# EasyEDA Pro project ProPrj_ct mini board_2024-09-02.epro

# Schematic MiniCT
Board Name: Board1; Create Date: 2024-08-28; Company: Jeffrey Hein; Drawn: Jeffrey Hein; Part Number: mini-ct-01
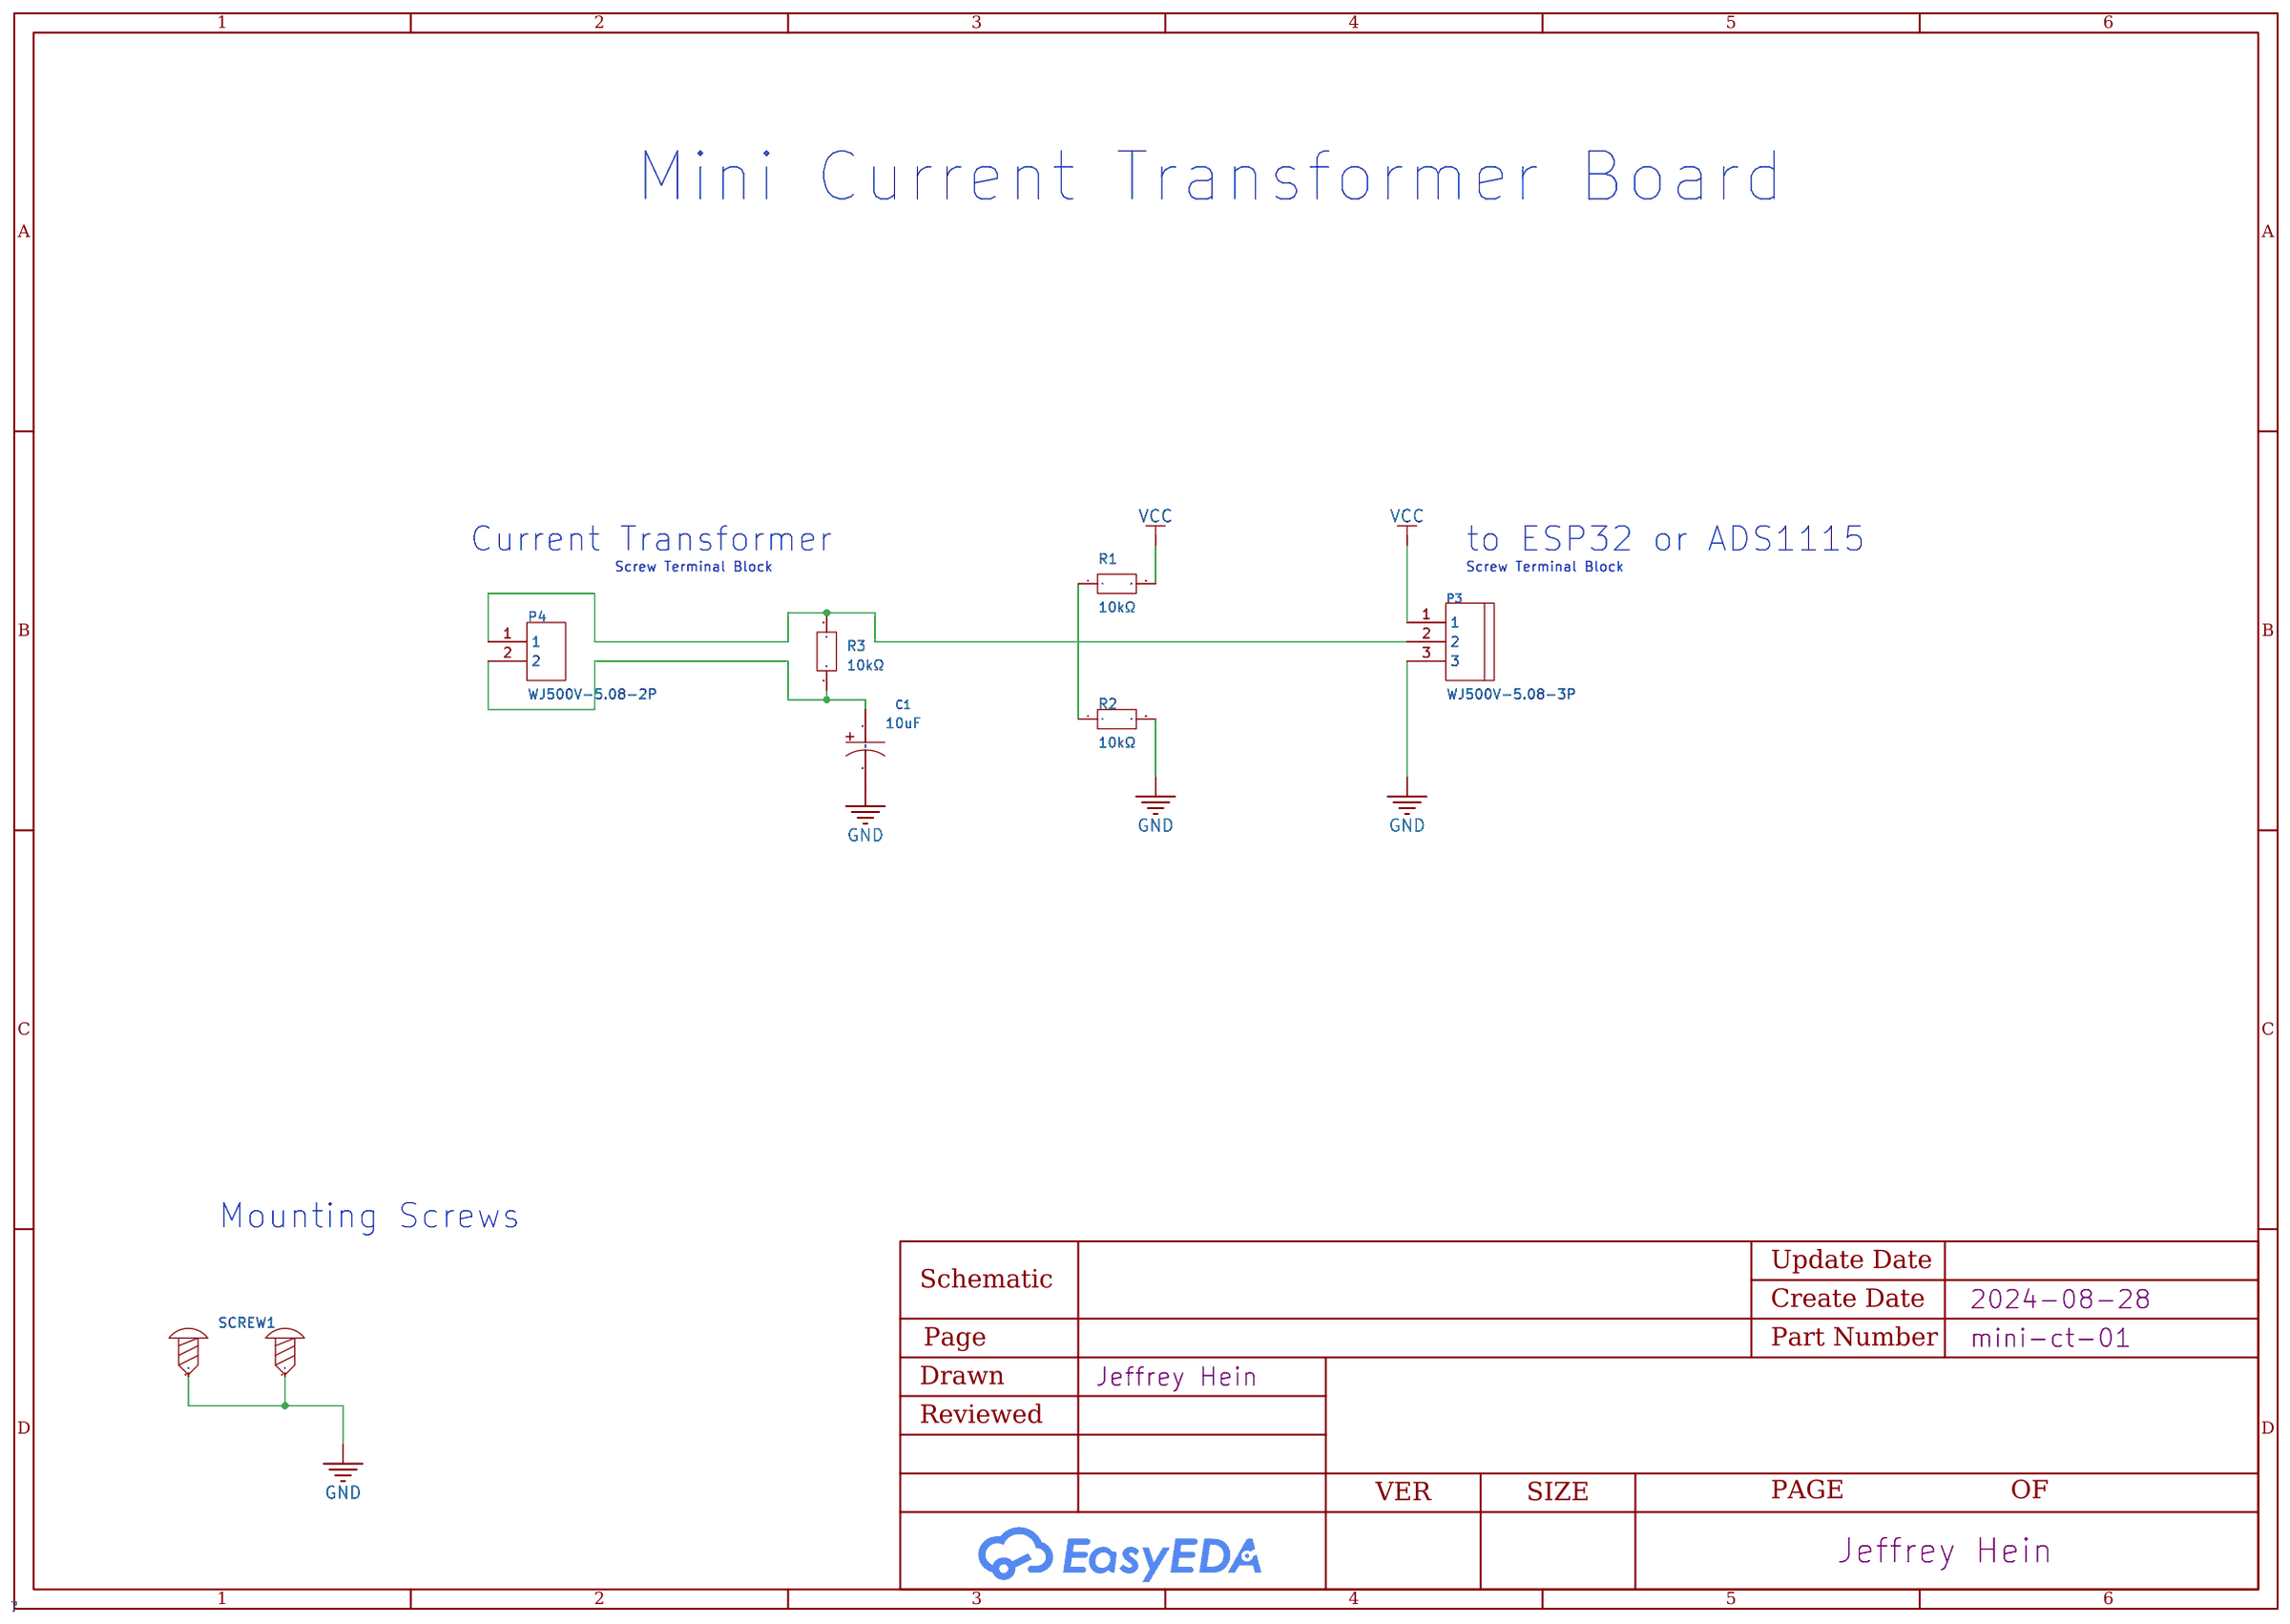
[diagram p0: schematic sheet]

## Parts
C1  10uF  [CAP-TH_BD5.0-P5.00-D1.0-FD]
P3  WJ500V-5.08-3P  [CONN-TH_3P-P5.00_WJ500V-5.08-3P]
P4  WJ500V-5.08-2P  [CONN-TH_2P-P5.00_WJ500V-5.08-2P]
R1  10kΩ  [RES-TH_BD2.4-L6.3-P10.30-D0.6]
R2  10kΩ  [RES-TH_BD2.4-L6.3-P10.30-D0.6]
R3  10kΩ  [RES-TH_BD2.4-L6.3-P10.30-D0.6]
SCREW1  -  [Screw-Hole-M4]
SCREW2  -  [Screw-Hole-M4]

## Library data of the parts
C1 = UVZ1C100MDD1TA: Capacitance: Tolerance:±20% Tolerance:±20% Rated Voltage: Ripple Current:35mA@120Hz Equivalent Series Resistance(ESR):- Lead Spacing:2mm φD: L: Lifetime @ Temp:1000hrs@105℃ Operating Temperature:-55℃~+105℃ Operating Temperature:-55℃~+105℃; LCSC Part Name: 10uF ±20% 16V; Supplier Part: C250876; Manufacturer: Nichicon(尼吉康); Supplier Footprint: 插件,D5xL11mm; Datasheet: https://atta.szlcsc.com/upload/public/pdf/source/20180925/C308870_1835EFB626D2D8CF3B207CFFD6F8F272.pdf; Supplier: LCSC; Tolerance: ±20%; Ripple Current: 35mA@120Hz; Lead Spacing: 2mm; Lifetime @ Temp: 1000hrs@105℃; Operating Temperature: -55℃~+105℃
P3 = WJ500V-5.08-3P: Structure:1x3P Pitch:5.08mm Color:Green Mounting Style:Straight Current Rating (Max):18A Voltage Rating (Max):250V Number of Pins:3P Number of Rows:1 Wire Gauge - AWG:14~30 Wire Gauge - AWG:14~30 Wire Gauge - mm2:2.5 Wire Gauge - mm2:2.5 Number of PINs Pe; LCSC Part Name: 5.08mm 1x3P 排数:1 每排P数:3 直插; Supplier Part: C72334; Manufacturer: KANGNEX(康奈克斯电气); Supplier Footprint: 插件,P=5.08mm; Datasheet: https://atta.szlcsc.com/upload/public/pdf/source/20191225/C72334_8A5EF831D67650233B6B1E3F2BC06274.pdf; Supplier: LCSC; Structure: 1x3P; Pitch: 5.08mm; Color: Green; Mounting Style: Straight; Current Rating (Max): 18A; Voltage Rating (Max): 250V; Number of Pins: 3P; Number of Rows: 1; Wire Gauge - AWG: 14~30; Wire Gauge - mm2: 2.5; Number of PINs Per Row: 3; Operating Temperature Range: -40℃~+105℃
P4 = WJ500V-5.08-2P: Structure:1x2P Pitch:5.08mm Color:Green Mounting Style:Straight Current Rating (Max):18A Voltage Rating (Max):250V Number of Pins:2P Number of Rows:1 Wire Gauge - AWG:14~30 Wire Gauge - AWG:14~30 Wire Gauge - mm2:2.5 Wire Gauge - mm2:2.5 Number of PINs Pe; LCSC Part Name: 1x2P 5.08mm 直插 排数:1 每排P数:2; Supplier Part: C8465; Manufacturer: KANGNEX(康奈克斯电气); Supplier Footprint: 插件,P=5.08mm; Datasheet: https://atta.szlcsc.com/upload/public/pdf/source/20191225/C8465_02D34CE5B5B4A53DF5891601D97FA9F4.pdf; Supplier: LCSC; Structure: 1x2P; Pitch: 5.08mm; Color: Green; Mounting Style: Straight; Current Rating (Max): 18A; Voltage Rating (Max): 250V; Number of Pins: 2P; Number of Rows: 1; Wire Gauge - AWG: 14~30; Wire Gauge - mm2: 2.5; Number of PINs Per Row: 2; Operating Temperature Range: -40℃~+105℃; Screw Specification: M2.5
R1-R3 = RN1/4W10KFT/BA1: Type:Metal Film Resistors Resistance: Tolerance:±1% Tolerance:±1% Overload Voltage (Max):250V Power(Watts):250mW Temperature Coefficient:±50ppm/℃ Temperature Coefficient:±50ppm/℃ Operating Temperature Range:-55℃~+125℃ Operating Temperature Range:-55℃~+125; LCSC Part Name: 10kΩ ±1% 250mW 金属膜电阻; Supplier Part: C410695; Manufacturer: Tyohm(幸亚电阻); Supplier Footprint: 插件,D2.4xL6.5mm; Datasheet: https://atta.szlcsc.com/upload/public/pdf/source/20190808/C410699_D126E64D28B638F1D73B58E9F61DFD9B.pdf; Supplier: LCSC; Type: Metal Film Resistors; Tolerance: ±1%; Overload Voltage (Max): 250V; Power(Watts): 250mW; Temperature Coefficient: ±50ppm/℃; Operating Temperature Range: -55℃~+125℃
SCREW1 SCREW2 = Screw-Hole-M4: Supplier Footprint: 插件

## Nets
GND: C1.2 P3.3 R2.2 SCREW1.1 SCREW2.1
VCC: P3.1 R1.2
$1N1917: R1.1 R2.1
$1N2936: C1.1 P4.2 R3.1
$1N2944: P3.2 P4.1 R3.2

## Notes on the sheet
- Mini Current Transformer Board
- Current Transformer
- to ESP32 or ADS1115
- Screw Terminal Block
- Screw Terminal Block
- Mounting Screws

# Board minictPCB
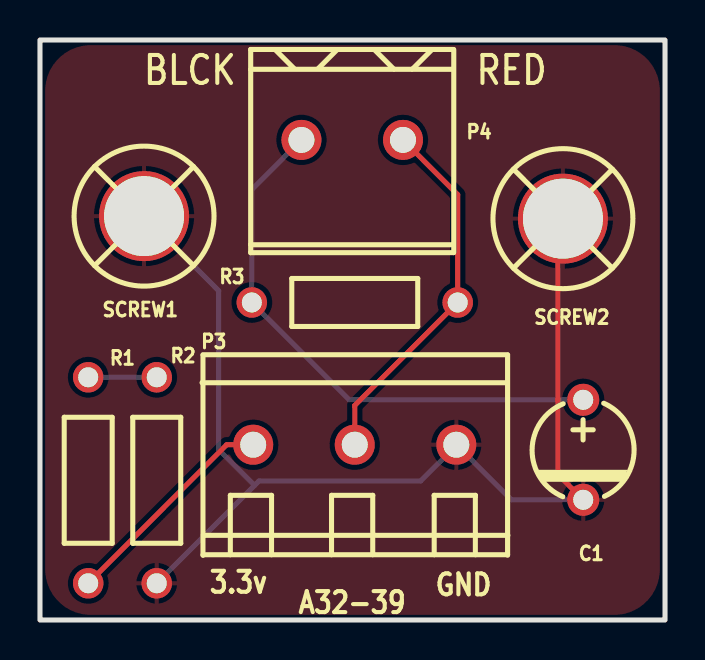
[diagram p1: board, top side]
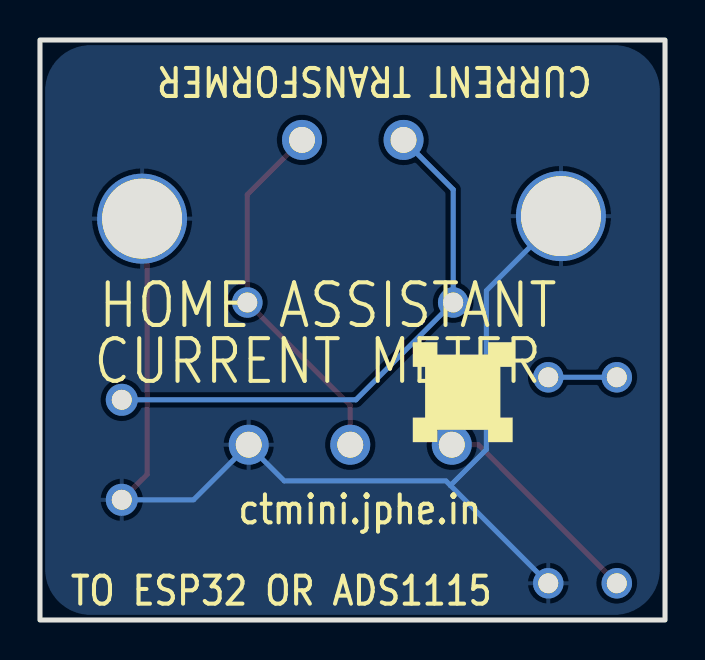
[diagram p2: board, bottom side, seen from below]

Outline 31.27 x 29 mm; copper layers: Top Layer, Bottom Layer. Coordinates in mm from the lower left corner of the outline.
Outline path: rectangle 0,29 31.27,0
Stack: Top Layer 0.035mm / Dielectric1 1.51mm FR4 er 4.5 / Bottom Layer 0.035mm

## Design rules (mm)
template: JLCPCB Capability(Two Layers Board)
spacing copperThickness1oz (default): track to track 0.102, other pairs 0.152 to 0.3
spacing copperThickness2oz: track to track 0.203, other pairs 0.152 to 0.3
track width copperThickness1oz (default): min 0.127, default 0.254, max 2.54
track width copperThickness2oz: min 0.203, default 0.254, max 2.54
differential pair differentialPair (default): width min 0.127, default 0.254, max 2.54; gap min 0.152, default 0.152
via viaSize (default): diameter min 0.5, default 0.61, max 10; hole min 0.3, default 0.305, max 6.3

## Placement (name value [footprint] x y rotation side)
C1  10uF  [CAP-TH_BD5.0-P5.00-D1.0-FD]  27.18 8.51 270 top
P3  WJ500V-5.08-3P  [CONN-TH_3P-P5.00_WJ500V-5.08-3P]  15.75 8.76 0 top
P4  WJ500V-5.08-2P  [CONN-TH_2P-P5.00_WJ500V-5.08-2P]  15.62 24 180 top
R1  10kΩ  [RES-TH_BD2.4-L6.3-P10.30-D0.6]  2.41 6.99 270 top
R2  10kΩ  [RES-TH_BD2.4-L6.3-P10.30-D0.6]  5.84 6.99 270 top
R3  10kΩ  [RES-TH_BD2.4-L6.3-P10.30-D0.6]  15.75 15.88 0 top
SCREW1  -  [Screw-Hole-M4]  5.21 20.19 0 top
SCREW2  -  [Screw-Hole-M4]  26.16 20.07 0 top

## Footprints (pads in the part's own frame, mm; a bottom-side part is the same pattern mirrored in y, then rotated)
CAP-TH_BD5.0-P5.00-D1.0-FD
  round 1.6 hole 1: 1(-2.5,0) 2(2.5,0)
CONN-TH_2P-P5.00_WJ500V-5.08-2P
  round 2 hole 1.3: 1(-2.54,0) 2(2.54,0)
CONN-TH_3P-P5.00_WJ500V-5.08-3P
  round 2 hole 1.3: 1(-5.08,0) 2(0,0) 3(5.08,0)
RES-TH_BD2.4-L6.3-P10.30-D0.6
  round 1.524 hole 1: 1(-5.15,0) 2(5.15,0)
Screw-Hole-M4
  round 4.5 hole 4: 1(0,0)

## Nets
As in the schematic.

## Routing (per net, layer and track width the routed paths; a pad name or vN(x,y) marks a point on that pad's centre or on a via; arc(x,y) is an arc through that point)
GND: length 55.8
  Top Layer w0.254: SCREW2.1 25.91,19.81 25.91,7.28 C1.2
  Bottom Layer w0.254: SCREW1.1 8.94,16.46 8.94,8.52 10.73,6.73 ; 20.84,8.75 23.58,6.01 C1.2 ; 20.84,8.75 19.05,6.95 10.96,6.95 10.73,6.73 ; 20.84,8.75 P3.3 ; 10.73,6.73 R2.2
VCC: length 11.1
  Top Layer w0.254: R1.2 9.34,8.76 P3.1
$1N1917: length 3.4
  Bottom Layer w0.254: R1.1 R2.1
$1N2936: length 27.8
  Bottom Layer w0.254: 13.08,24 10.6,21.52 R3.1 15.46,11.01 C1.1
$1N2944: length 18.5
  Top Layer w0.254: P4.1 20.9,21.27 R3.2 15.75,10.73 P3.2

## Copper pours and planes (outline as drawn; the poured copper is in the pictures)
GND on Top Layer: -0.89,30.23 32.51,30.23 32.51,-0.63 -0.89,-0.63
GND on Bottom Layer: -2.29,31.12 33.66,31.12 33.66,-1.27 -2.29,-1.27

## Text on the board
Bottom Silkscreen Layer: ctmini.jphe.in | TO ESP32 OR ADS1115 | CURRENT TRANSFORMER | HOME ASSISTANT | CURRENT METER
Top Silkscreen Layer: 3.3v | A32-39 | GND | BLCK | RED
